# EasyEDA schematic Foot Contact Switch_2020-11-27_13-26-25.json
TITLE: Sheet_1; REV: 1.0; Date: 2020-11-27; Sheet: 1/1; Drawn By: Martin BU; Company: Your Company
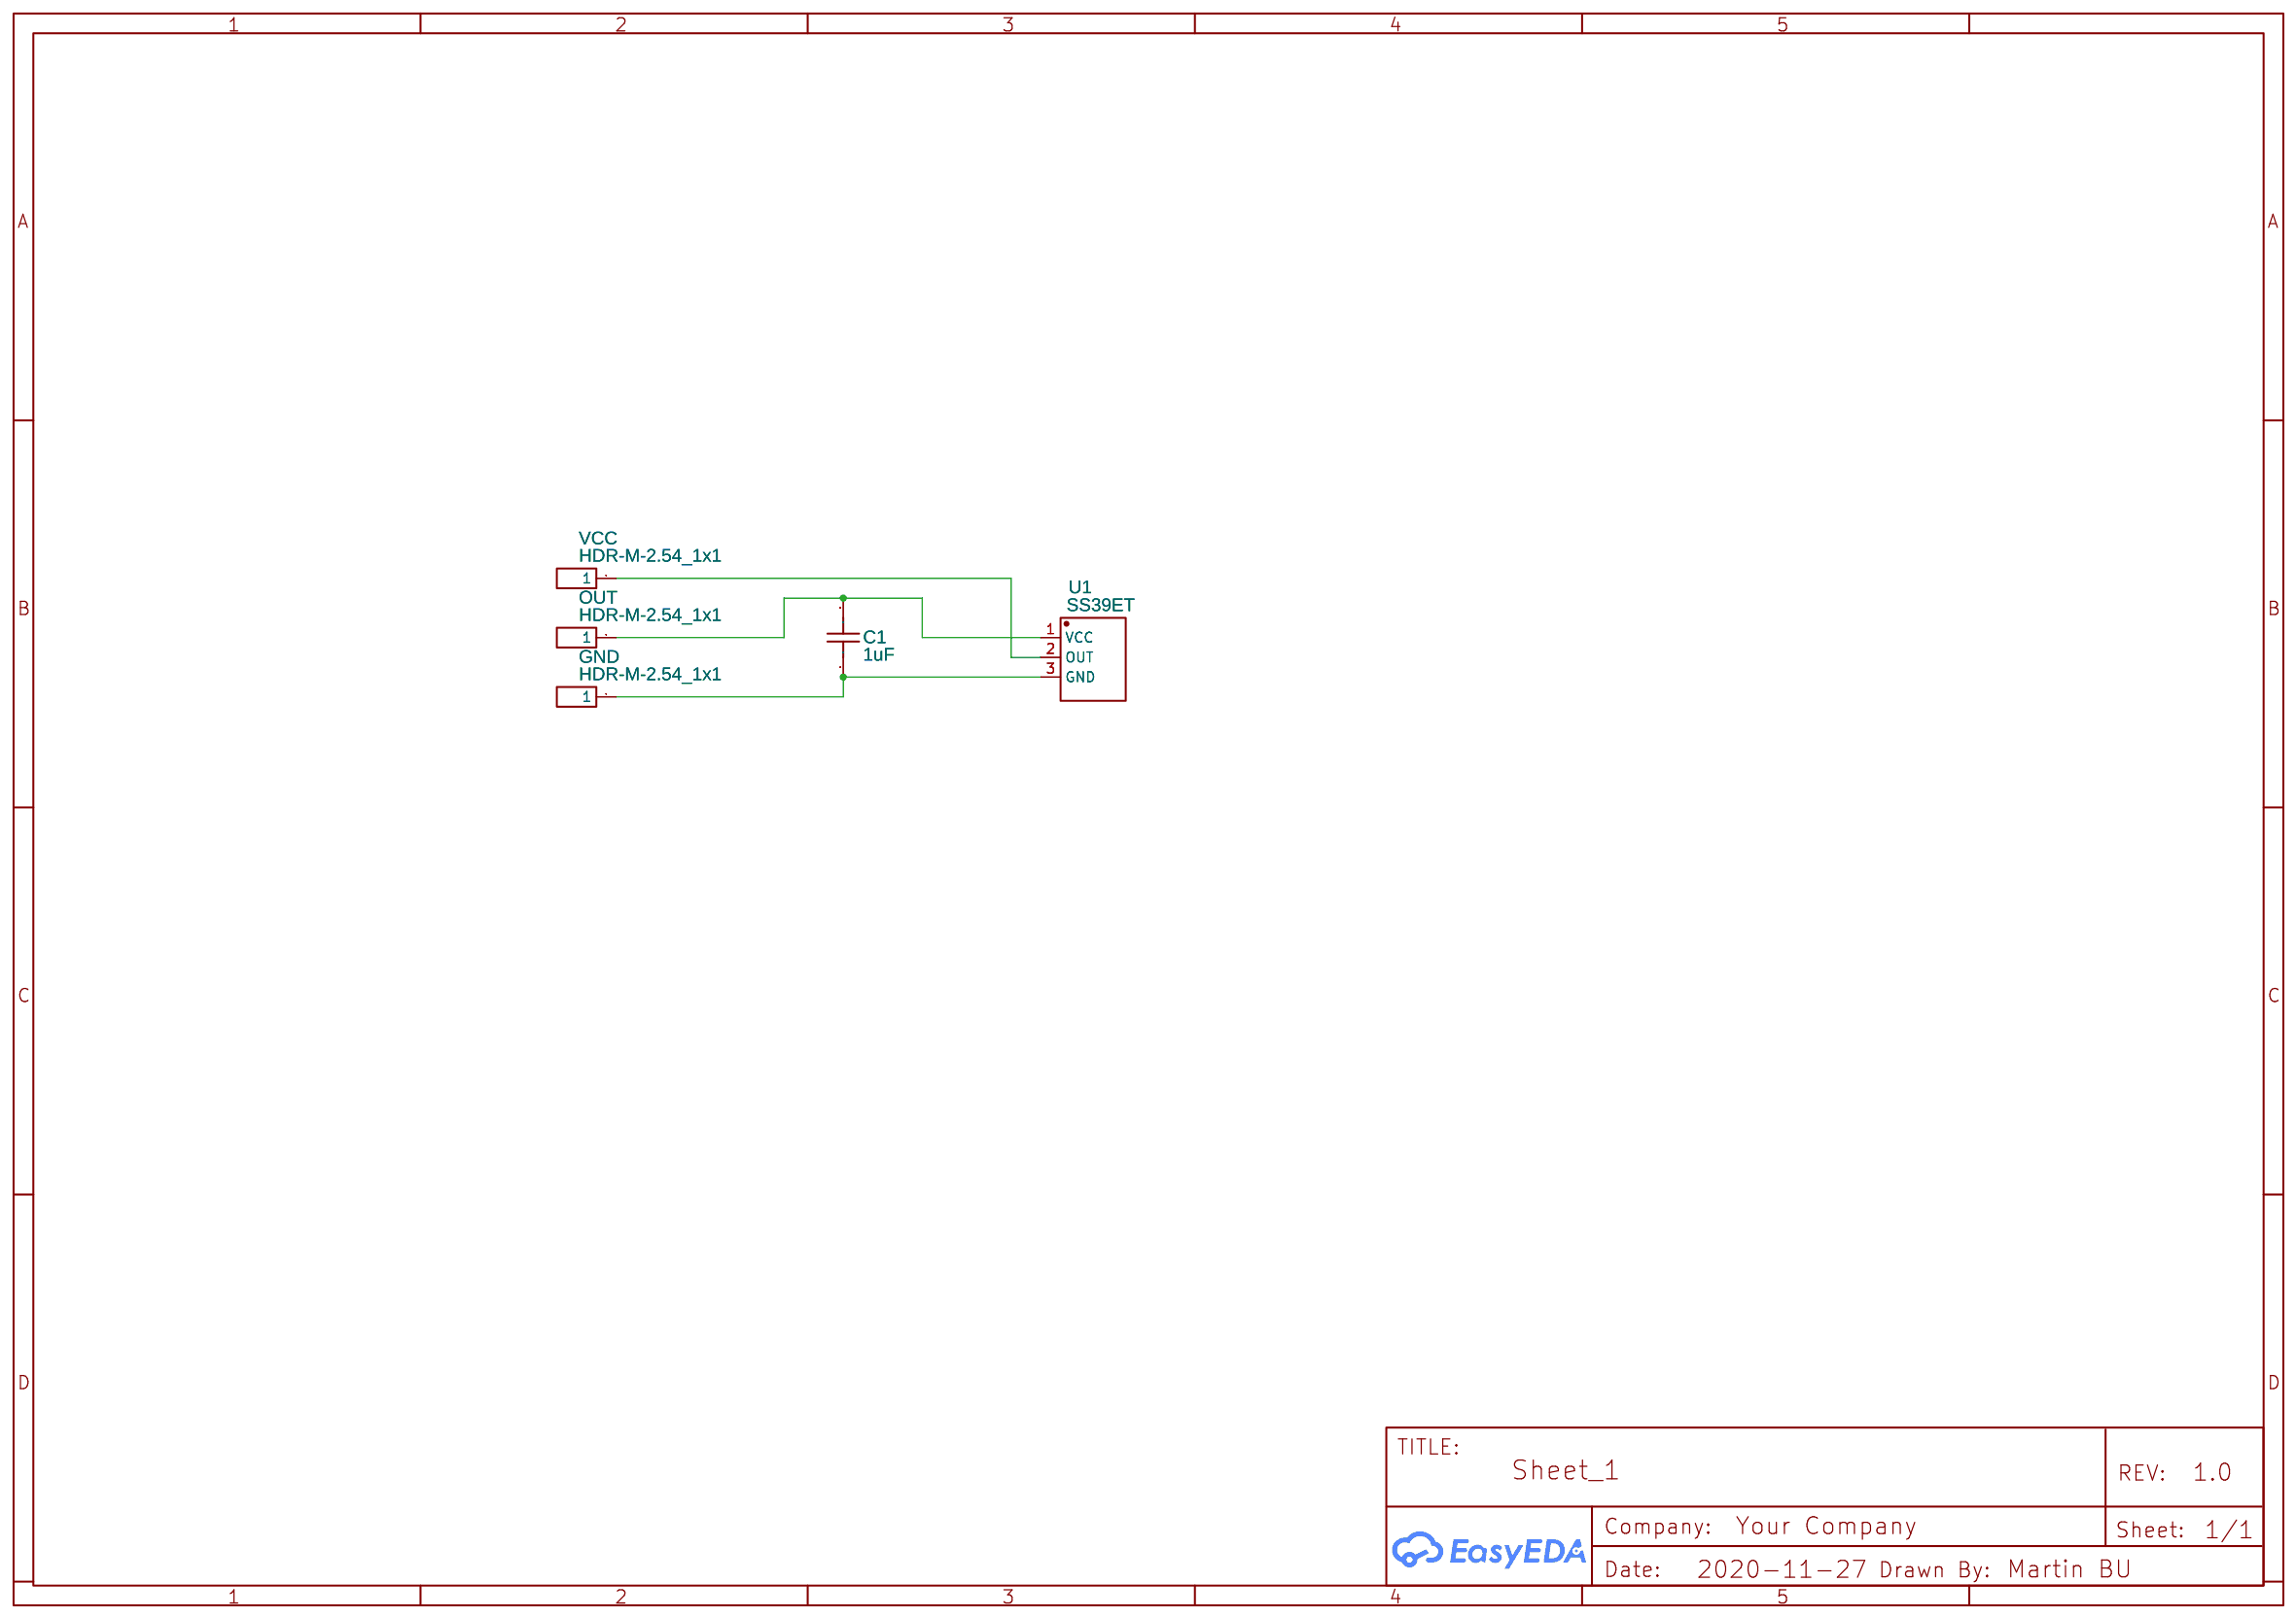
[diagram p0: schematic sheet]

## Parts
C1  1uF  [0402]
GND  HDR-M-2.54_1x1  [HDR-M-2.54_1X1]
OUT  HDR-M-2.54_1x1  [HDR-M-2.54_1X1]
U1  SS39ET  [SOT-23-3_L2.9-W1.3-P1.90-LS2.4-BR]
VCC  HDR-M-2.54_1x1  [HDR-M-2.54_1X1]

## Library data of the parts
C1 = Capacitor, 1uF, 0402: Supplier: LCSC; Supplier Part: C165204; Manufacturer: AVX; Manufacturer Part: 04026D105KAT2A; Contributor: LCSC
GND OUT VCC = HDR-M-2.54_1x1: Supplier Part: C81276; Supplier: LCSC; Contributor: LCEDA_Lib
U1 = SS39ET: Supplier: LCSC; Manufacturer: Honeywell; Contributor: LCSC; Supplier Part: C126669; SMT Type: Extend; JLCPCB SMD: Yes

## Nets
Net-(C1-1): C1.1 GND.1 U1.3(GND)
Net-(C1-2): C1.2 OUT.1 U1.1(VCC)
Net-(U1-2): U1.2(OUT) VCC.1
